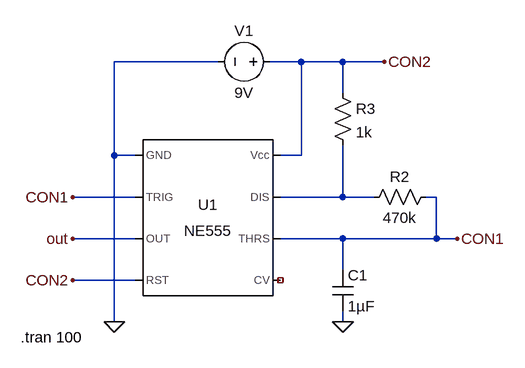
[diagram p0: schematic 555_timer.asc]
555_timer.asc, the LTspice schematic file:
Version 4.1
SHEET 1 1804 680
WIRE 208 -80 48 -80
WIRE 336 -80 288 -80
WIRE 400 -80 336 -80
WIRE 464 -80 400 -80
WIRE 400 -32 400 -80
WIRE 48 64 48 -80
WIRE 80 64 48 64
WIRE 336 64 336 -80
WIRE 336 64 304 64
WIRE 80 128 -16 128
WIRE 400 128 400 48
WIRE 400 128 304 128
WIRE 448 128 400 128
WIRE 544 128 528 128
WIRE 80 192 -16 192
WIRE 400 192 304 192
WIRE 544 192 544 128
WIRE 544 192 400 192
WIRE 576 192 544 192
WIRE 400 240 400 192
WIRE 80 256 -16 256
WIRE 48 320 48 64
WIRE 400 320 400 304
FLAG -16 128 CON1
FLAG 576 192 CON1
FLAG 48 320 0
FLAG -16 256 CON2
FLAG 464 -80 CON2
FLAG 400 320 0
FLAG -16 192 out
SYMBOL Misc\\NE555 192 160 R0
SYMATTR InstName U1
SYMBOL res 384 -48 R0
SYMATTR InstName R3
SYMATTR Value 1k
SYMBOL cap 384 240 R0
SYMATTR InstName C1
SYMATTR Value 1µF
SYMBOL res 544 112 R90
WINDOW 0 0 56 VBottom 2
WINDOW 3 32 56 VTop 2
SYMATTR InstName R2
SYMATTR Value 470k
SYMBOL voltage 304 -80 R90
WINDOW 0 -32 56 VBottom 2
WINDOW 3 32 56 VTop 2
SYMATTR InstName V1
SYMATTR Value 9V
TEXT -96 344 Left 2 !.tran 100

The netlist it stands for:
* 555_timer.asc
X§U1 0 CON1 out CON2 NC_01 CON1 N001 CON2 NE555  ; pins GND TRIG OUT RST CV THRS DIS Vcc
R3 CON2 N001 1k
C1 CON1 0 1µF
R2 CON1 N001 470k
V1 CON2 0 9V
.tran 100
.lib NE555.sub
.backanno
.end